# Altium schematic sheet JTAG&Trace.SchDoc: STM324x9I-EVAL JTAG&Trace
size A4; DocumentNumber: 17; Revision: B.3; SheetNumber: 17; SheetTotal: 17
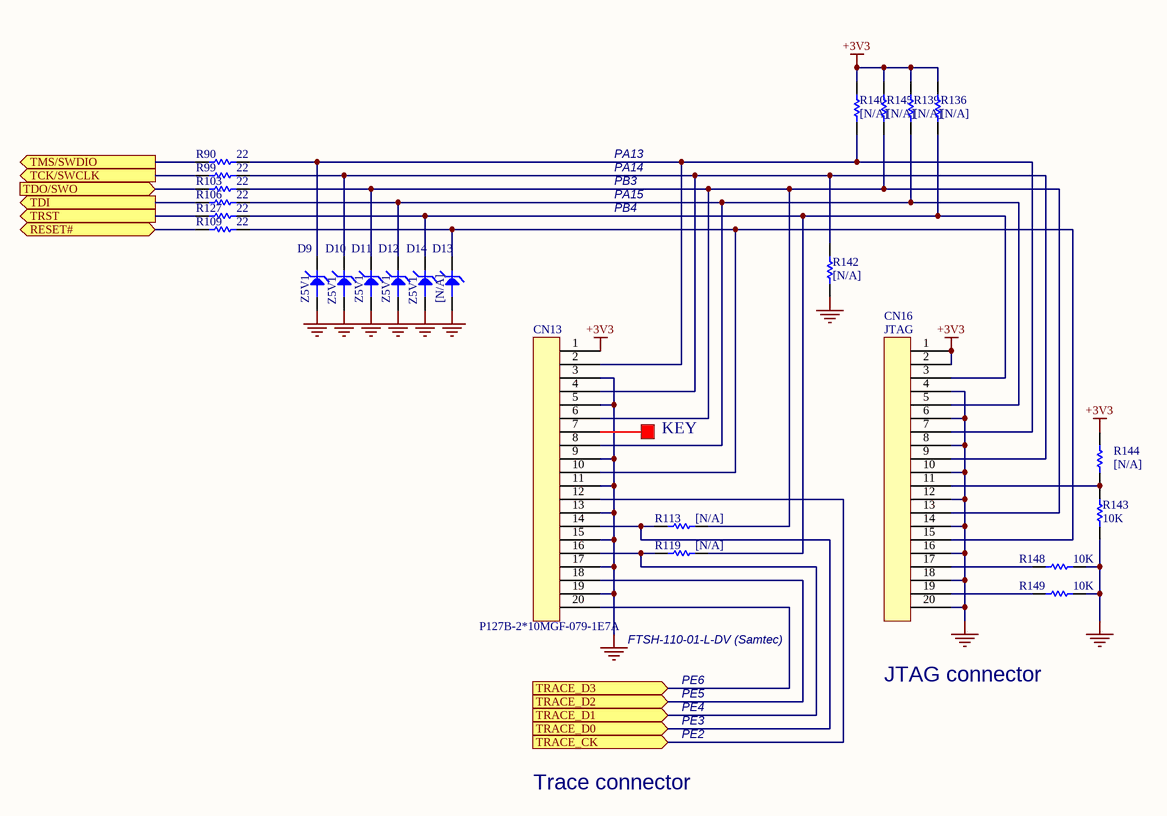
[diagram p0: JTAG&Trace.SchDoc]

## Parts
CN13  P127B-2*10MGF-079-1E7A  [FTSH-110-01-L-DV]
CN16  JTAG  [IDC20S]
D9  Z5V1  [SOT23-213]
D10  Z5V1  [SOT23-213]
D11  Z5V1  [SOT23-213]
D12  Z5V1  [SOT23-213]
D13  [N/A]  [SOT23-213]
D14  Z5V1  [SOT23-213]
R90  22  [0603R]
R99  22  [0603R]
R103  22  [0603R]
R106  22  [0603R]
R109  22  [0603R]
R113  [N/A]  [0603R]
R119  [N/A]  [0603R]
R127  22  [0603R]
R136  [N/A]  [0603R]
R139  [N/A]  [0603R]
R140  [N/A]  [0603R]
R142  [N/A]  [0603R]
R143  10K  [0603R]
R144  [N/A]  [0603R]
R145  [N/A]  [0603R]
R148  10K  [0603R]
R149  10K  [0603R]

## Ports
RESET# (bidir), TCK/SWCLK (out), TDI (out), TDO/SWO (in), TMS/SWDIO (out), TRACE_CK (in), TRACE_D0 (in), TRACE_D1 (in), TRACE_D2 (in), TRACE_D3 (in), TRST (out)

## Nets
+3V3: CN13.1 CN16.1 CN16.2 R136.2 R139.2 R140.2 R144.2 R145.2
GND: CN13.3 CN13.5 CN13.9 CN13.11 CN13.13 CN13.15 CN13.17 CN13.19 CN16.4 CN16.6 CN16.8 CN16.10 CN16.12 CN16.14 CN16.16 CN16.18 CN16.20 D9.2 D10.2 D11.2 D12.2 D13.2 D14.2 R142.1 R143.1 R148.1 R149.1
RESET#: R109.2 ; port RESET#
TCK/SWCLK: R99.2 ; port TCK/SWCLK
TDI: R106.2 ; port TDI
TDO/SWO: R103.2 ; port TDO/SWO
TMS/SWDIO: R90.2 ; port TMS/SWDIO
TRACE_CK: CN13.12 ; port TRACE_CK
TRACE_D0: CN13.14 R113.1 ; port TRACE_D0
TRACE_D1: CN13.16 R119.1 ; port TRACE_D1
TRACE_D2: CN13.18 ; port TRACE_D2
TRACE_D3: CN13.20 ; port TRACE_D3
TRST: R127.2 ; port TRST
NetCN13_2: CN13.2 CN16.7 D9.3 R90.1 R140.1
NetCN13_4: CN13.4 CN16.9 D10.3 R99.1 R142.2
NetCN13_6: CN13.6 CN16.13 D11.3 R103.1 R113.2 R145.1
NetCN13_8: CN13.8 CN16.5 D12.3 R106.1 R139.1
NetCN13_10: CN13.10 CN16.15 D13.3 R109.1
NetCN16_3: CN16.3 D14.3 R119.2 R127.1 R136.1
NetCN16_11: CN16.11 R143.2 R144.1
NetCN16_17: CN16.17 R148.2
NetCN16_19: CN16.19 R149.2

Not connected (* = marked no-connect by the designer): CN13 7

## Notes on the sheet
- PA13
- PA14
- PB3
- PA15
- PB4
- KEY
- (near CN13) FTSH-110-01-L-DV (Samtec)
- PE6
- JTAG connector
- PE5
- PE4
- PE3
- PE2
- Trace connector
- Title:
- Project:
- Size:
- Revision:
- Variant:
- A4
- -
- Date:
- Reference:
- Sheet:
- of

## Library data of the parts
CN13 CN16 = 20PIN1
D9-D14 = BATS5V6
R90 R99 R103 R106 R109 R113 R119 R127 R136 R139 R140 R142-R145 R148 R149 = Res1: Resistor; Value: 1K; Published: 8-Jun-2000; Revision: July-2002: Re-released for DXP Platform.; Publisher: Altium Limited